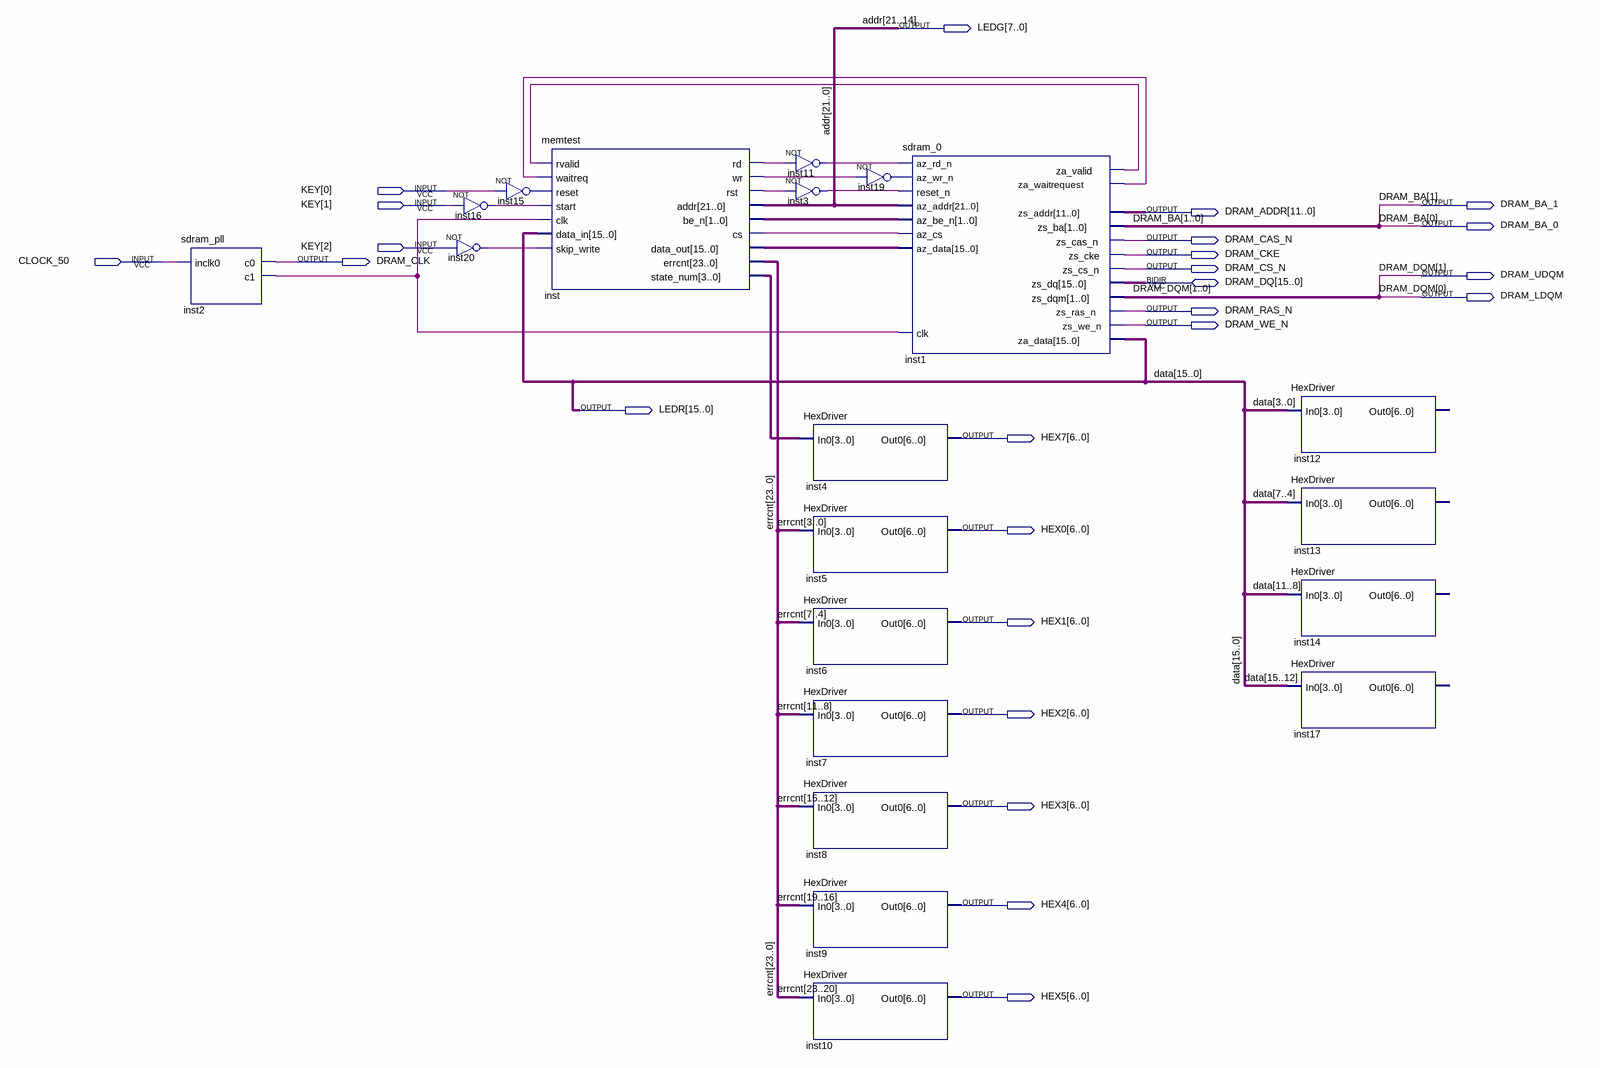
[diagram p0: schematic sheet]
// Quartus schematic memcntl2.bdf as structural Verilog: 20 symbols, 25 pins
module memcntl2 (
  input  [2:0] KEY,
  input  CLOCK_50,
  inout  [15:0] DRAM_DQ,
  output [7:0] LEDG,
  output DRAM_BA_1,
  output [11:0] DRAM_ADDR,
  output DRAM_BA_0,
  output DRAM_CAS_N,
  output DRAM_CKE,
  output DRAM_CLK,
  output DRAM_CS_N,
  output DRAM_UDQM,
  output DRAM_LDQM,
  output DRAM_RAS_N,
  output DRAM_WE_N,
  output [15:0] LEDR,
  output [6:0] HEX7,
  output [6:0] HEX0,
  output [6:0] HEX1,
  output [6:0] HEX2,
  output [6:0] HEX3,
  output [6:0] HEX4,
  output [6:0] HEX5
);

  wire inst1_za_valid, inst1_za_waitrequest, inst2_c1, inst3_out, inst11_out, inst15_out, inst16_out,
       inst19_out, inst20_out, inst_cs, inst_rd, inst_rst, inst_wr;
  wire [1:0] inst_be_n;
  wire [3:0] inst_state_num;
  wire [13:0] addr;
  wire [15:0] inst_data_out;
  wire [23:0] errcnt;

  sdram_pll inst2 (.inclk0(CLOCK_50), .c0(DRAM_CLK), .c1(inst2_c1));
  not inst16 (inst16_out, KEY[1]);
  not inst20 (inst20_out, KEY[2]);
  not inst15 (inst15_out, KEY[0]);
  memtest inst (
    .rvalid(inst1_za_valid), .waitreq(inst1_za_waitrequest), .reset(inst15_out), .start(inst16_out),
    .clk(inst2_c1), .data_in(LEDR), .skip_write(inst20_out), .rd(inst_rd), .wr(inst_wr), .rst(inst_rst),
    .addr({LEDG, addr}), .be_n(inst_be_n), .cs(inst_cs), .data_out(inst_data_out), .errcnt(errcnt),
    .state_num(inst_state_num));
  not inst11 (inst11_out, inst_rd);
  not inst3 (inst3_out, inst_rst);
  HexDriver inst4 (.In0(inst_state_num), .Out0(HEX7));
  HexDriver inst5 (.In0(errcnt[3:0]), .Out0(HEX0));
  HexDriver inst6 (.In0(errcnt[7:4]), .Out0(HEX1));
  HexDriver inst7 (.In0(errcnt[11:8]), .Out0(HEX2));
  HexDriver inst8 (.In0(errcnt[15:12]), .Out0(HEX3));
  HexDriver inst9 (.In0(errcnt[19:16]), .Out0(HEX4));
  HexDriver inst10 (.In0(errcnt[23:20]), .Out0(HEX5));
  not inst19 (inst19_out, inst_wr);
  sdram_0 inst1 (
    .az_addr({LEDG, addr}), .az_be_n(inst_be_n), .az_cs(inst_cs), .az_data(inst_data_out),
    .az_rd_n(inst11_out), .az_wr_n(inst19_out), .clk(inst2_c1), .reset_n(inst3_out), .za_data(LEDR),
    .za_valid(inst1_za_valid), .za_waitrequest(inst1_za_waitrequest), .zs_addr(DRAM_ADDR),
    .zs_ba({DRAM_BA_1, DRAM_BA_0}), .zs_cas_n(DRAM_CAS_N), .zs_cke(DRAM_CKE), .zs_cs_n(DRAM_CS_N),
    .zs_dqm({DRAM_UDQM, DRAM_LDQM}), .zs_ras_n(DRAM_RAS_N), .zs_we_n(DRAM_WE_N), .zs_dq(DRAM_DQ));
  HexDriver inst12 (.In0(LEDR[3:0]));  // open: Out0
  HexDriver inst13 (.In0(LEDR[7:4]));  // open: Out0
  HexDriver inst14 (.In0(LEDR[11:8]));  // open: Out0
  HexDriver inst17 (.In0(LEDR[15:12]));  // open: Out0

  // Other names for the same wires on the sheet: addr[21:14] = LEDG; DRAM_BA[1:0] = {DRAM_BA_1, DRAM_BA_0};
  //   DRAM_DQM[1:0] = {DRAM_UDQM, DRAM_LDQM}; data[15:0] = LEDR
endmodule
